# Altium schematic sheet Processing.SchDoc
size A3
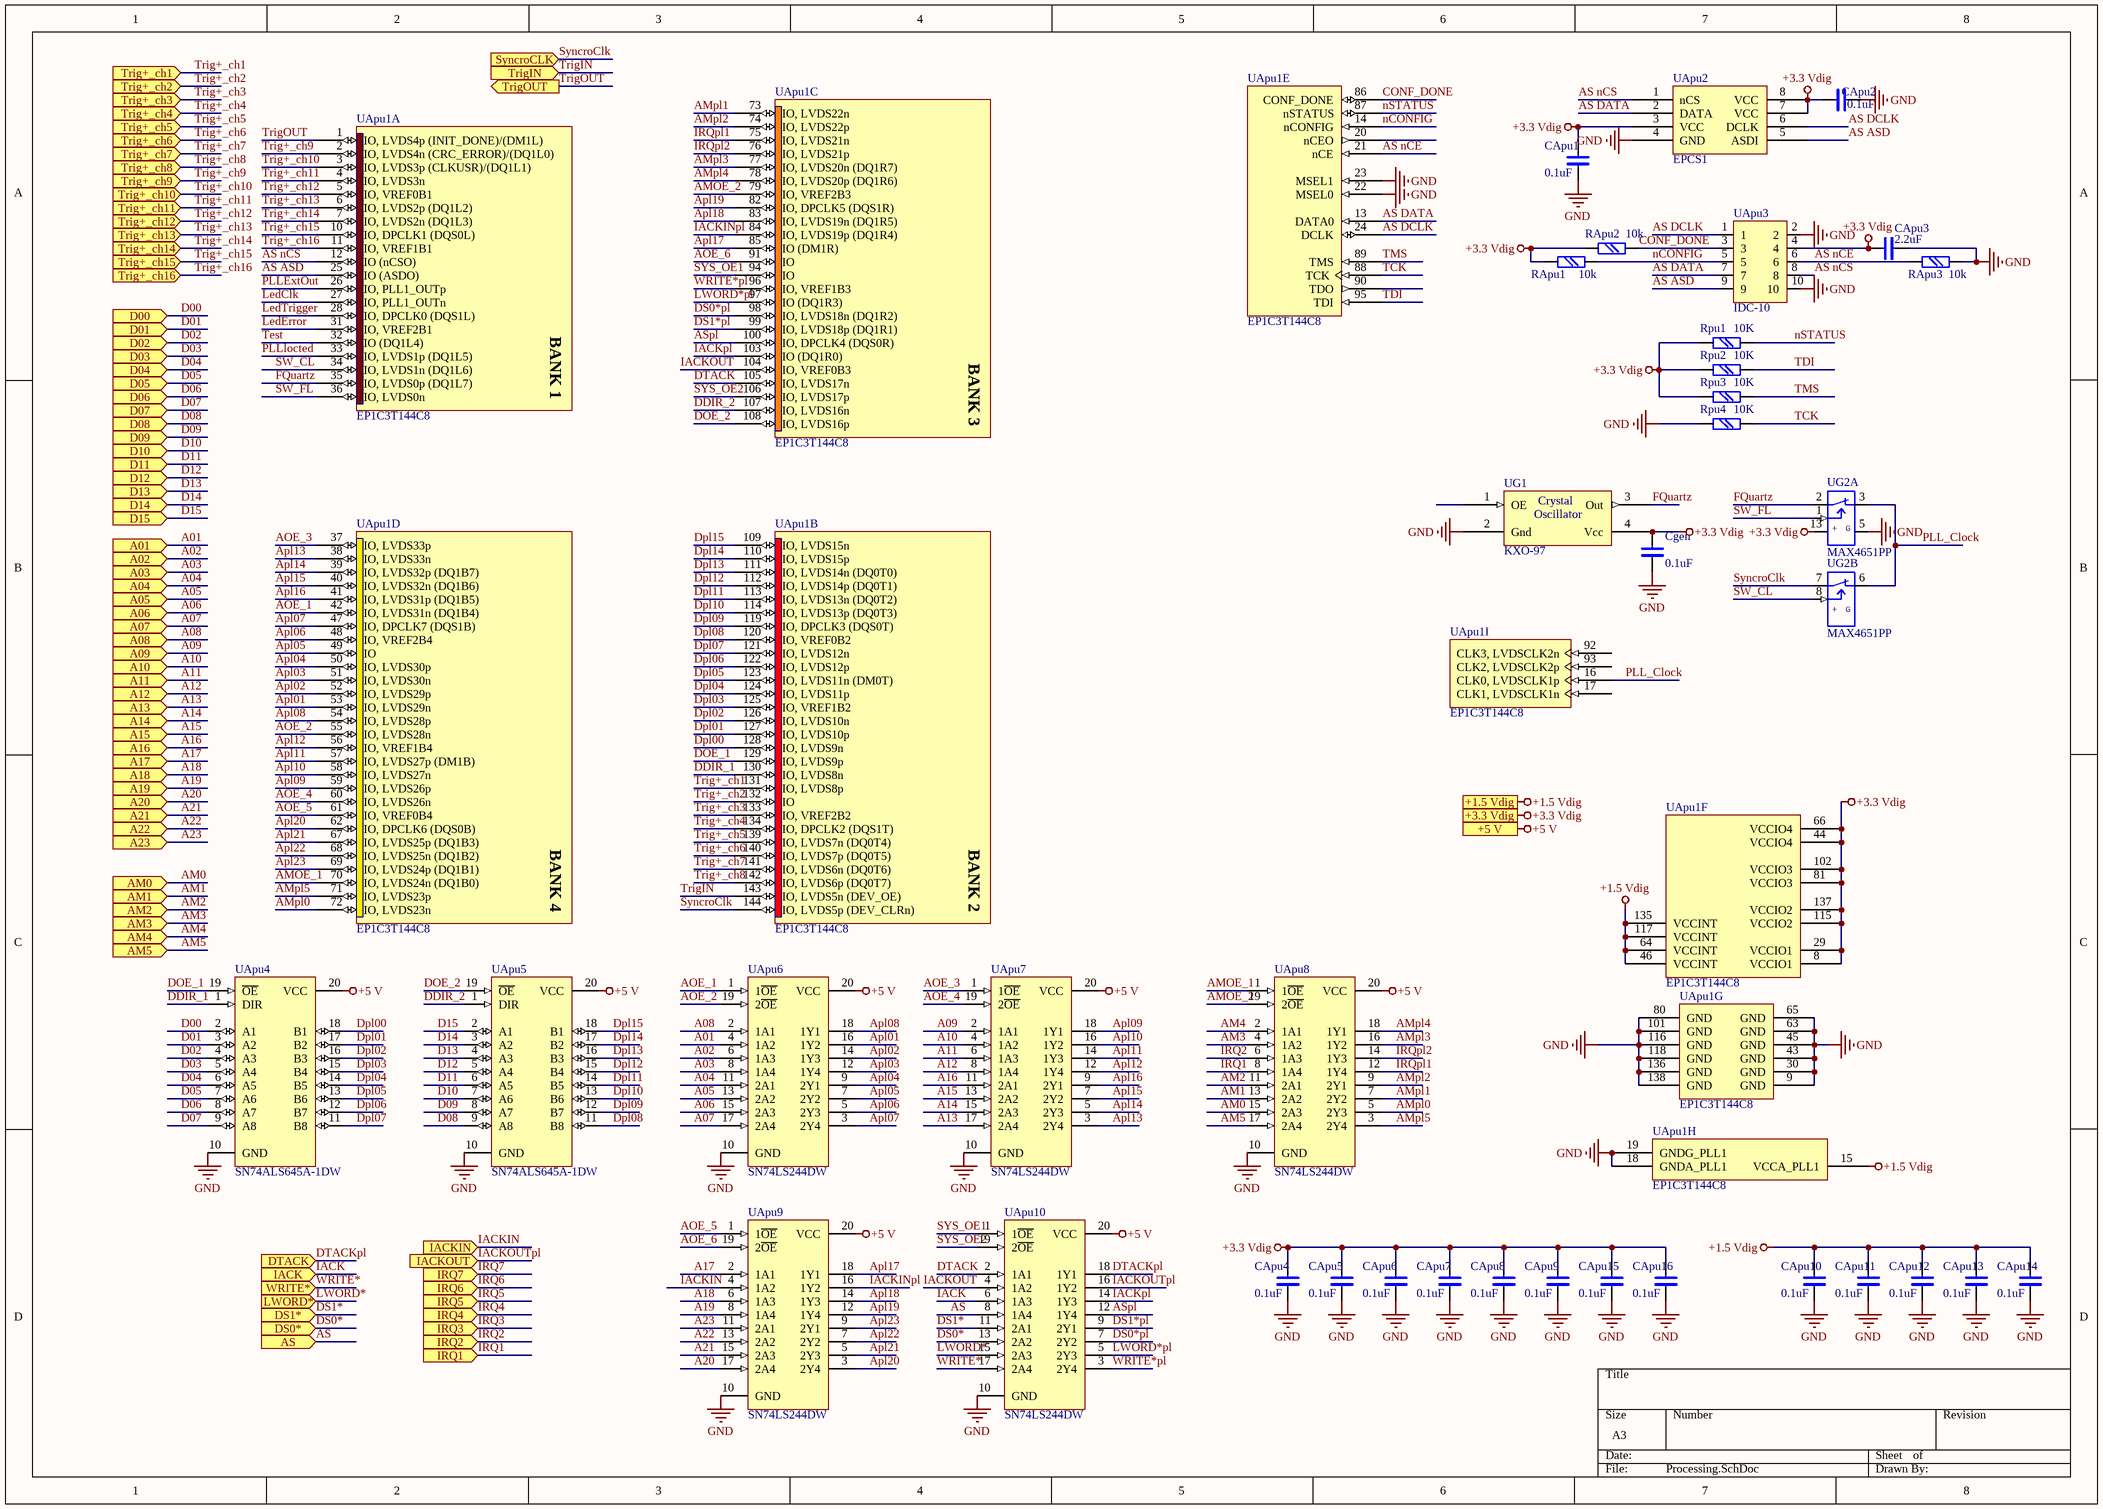
[diagram p0: Processing.SchDoc]

## Parts
CApu1  0.1uF  [chip0805]
CApu2  0.1uF  [chip0805]
CApu3  2.2uF  [chip0805]
CApu4  0.1uF  [chip0805]
CApu5  0.1uF  [chip0805]
CApu6  0.1uF  [chip0805]
CApu7  0.1uF  [chip0805]
CApu8  0.1uF  [chip0805]
CApu9  0.1uF  [chip0805]
CApu10  0.1uF  [chip0805]
CApu11  0.1uF  [chip0805]
CApu12  0.1uF  [chip0805]
CApu13  0.1uF  [chip0805]
CApu14  0.1uF  [chip0805]
CApu15  0.1uF  [chip0805]
CApu16  0.1uF  [chip0805]
Cgen  0.1uF  [chip0805]
RApu1  10k  [chip0805]
RApu2  10k  [chip0805]
RApu3  10k  [chip0805]
Rpu1  10K  [chip0805]
Rpu2  10K  [chip0805]
Rpu3  10K  [chip0805]
Rpu4  10K  [chip0805]
UApu1  EP1C3T144C8  [TQFP144_N]  (parts A,B,C,D,E,F,G,H,I of 9)
UApu2  EPCS1  [8SO200]
UApu3  IDC-10  [IDC10]
UApu4  SN74ALS645A-1DW  [DW020_N]
UApu5  SN74ALS645A-1DW  [DW020_N]
UApu6  SN74LS244DW  [DW020_N]
UApu7  SN74LS244DW  [DW020_N]
UApu8  SN74LS244DW  [DW020_N]
UApu9  SN74LS244DW  [DW020_N]
UApu10  SN74LS244DW  [DW020_N]
UG1  KXO-97  [SG-636]
UG2  MAX4651PP  [16SOIC150]  (parts A,B of 4)

## Ports
+1.5 Vdig (in), +3.3 Vdig (in), +5 V (in), A01 (in), A02 (in), A03 (in), A04 (in), A05 (in), A06 (in), A07 (in), A08 (in), A09 (in), A10 (in), A11 (in), A12 (in), A13 (in), A14 (in), A15 (in), A16 (in), A17 (in), A18 (in), A19 (in), A20 (in), A21 (in), A22 (in), A23 (in), AM0 (in), AM1 (in), AM2 (in), AM3 (in), AM4 (in), AM5 (in), AS (in), D00 (in), D01 (in), D02 (in), D03 (in), D04 (in), D05 (in), D06 (in), D07 (in), D08 (in), D09 (in), D10 (in), D11 (in), D12 (in), D13 (in), D14 (in), D15 (in), DS0* (in), DS1* (in), DTACK (in), IACK (in), IACKIN (in), IACKOUT (in), IRQ1 (in), IRQ2 (in), IRQ3 (in), IRQ4 (in), IRQ5 (in), IRQ6 (in), IRQ7 (in), LWORD* (in), SyncroCLK (in), Trig+_ch1 (in), Trig+_ch2 (in), Trig+_ch3 (in), Trig+_ch4 (in), Trig+_ch5 (in), Trig+_ch6 (in), Trig+_ch7 (in), Trig+_ch8 (in), Trig+_ch9 (in), Trig+_ch10 (in), Trig+_ch11 (in), Trig+_ch12 (in), Trig+_ch13 (in), Trig+_ch14 (in), Trig+_ch15 (in), Trig+_ch16 (in), TrigIN (in), TrigOUT (out), WRITE* (in)

## Nets
+1.5 Vdig: CApu10.2 CApu11.2 CApu12.2 CApu13.2 CApu14.2 UApu1.15(VCCA_PLL1) UApu1.46(VCCINT) UApu1.64(VCCINT) UApu1.117(VCCINT) UApu1.135(VCCINT) ; port +1.5 Vdig
+3.3 Vdig: CApu1.2 CApu2.2 CApu3.1 CApu4.2 CApu5.2 CApu6.2 CApu7.2 CApu8.2 CApu9.2 CApu15.2 CApu16.2 Cgen.2 RApu1.1 RApu2.1 Rpu1.1 Rpu2.1 Rpu3.1 UApu1.8(VCCIO1) UApu1.29(VCCIO1) UApu1.44(VCCIO4) UApu1.66(VCCIO4) UApu1.81(VCCIO3) UApu1.102(VCCIO3) UApu1.115(VCCIO2) UApu1.137(VCCIO2) UApu2.3(VCC) UApu2.7(VCC) UApu2.8(VCC) UApu3.4 UG1.4(Vcc) UG2.13(VCC) ; port +3.3 Vdig
+5 V: UApu4.20(VCC) UApu5.20(VCC) UApu6.20(VCC) UApu7.20(VCC) UApu8.20(VCC) UApu9.20(VCC) UApu10.20(VCC) ; port +5 V
GND: CApu1.1 CApu2.1 CApu3.2 CApu4.1 CApu5.1 CApu6.1 CApu7.1 CApu8.1 CApu9.1 CApu10.1 CApu11.1 CApu12.1 CApu13.1 CApu14.1 CApu15.1 CApu16.1 Cgen.1 RApu3.2 Rpu4.1 UApu1.9(GND) UApu1.18(GNDA_PLL1) UApu1.19(GNDG_PLL1) UApu1.22(MSEL0) UApu1.23(MSEL1) UApu1.30(GND) UApu1.43(GND) UApu1.45(GND) UApu1.63(GND) UApu1.65(GND) UApu1.80(GND) UApu1.101(GND) UApu1.116(GND) UApu1.118(GND) UApu1.136(GND) UApu1.138(GND) UApu2.4(GND) UApu3.2 UApu3.10 UApu4.10(GND) UApu5.10(GND) UApu6.10(GND) UApu7.10(GND) UApu8.10(GND) UApu9.10(GND) UApu10.10(GND) UG1.2(Gnd) UG2.5(GND)
A01: UApu6.4(1A2) ; port A01
A02: UApu6.6(1A3) ; port A02
A03: UApu6.8(1A4) ; port A03
A04: UApu6.11(2A1) ; port A04
A05: UApu6.13(2A2) ; port A05
A06: UApu6.15(2A3) ; port A06
A07: UApu6.17(2A4) ; port A07
A08: UApu6.2(1A1) ; port A08
A09: UApu7.2(1A1) ; port A09
A10: UApu7.4(1A2) ; port A10
A11: UApu7.6(1A3) ; port A11
A12: UApu7.8(1A4) ; port A12
A13: UApu7.17(2A4) ; port A13
A14: UApu7.15(2A3) ; port A14
A15: UApu7.13(2A2) ; port A15
A16: UApu7.11(2A1) ; port A16
A17: UApu9.2(1A1) ; port A17
A18: UApu9.6(1A3) ; port A18
A19: UApu9.8(1A4) ; port A19
A20: UApu9.17(2A4) ; port A20
A21: UApu9.15(2A3) ; port A21
A22: UApu9.13(2A2) ; port A22
A23: UApu9.11(2A1) ; port A23
AM0: UApu8.15(2A3) ; port AM0
AM1: UApu8.13(2A2) ; port AM1
AM2: UApu8.11(2A1) ; port AM2
AM3: UApu8.4(1A2) ; port AM3
AM4: UApu8.2(1A1) ; port AM4
AM5: UApu8.17(2A4) ; port AM5
AMOE_1: UApu1.70(IO,_LVDS24n_(DQ1B0)) UApu8.1(1~{OE})
AMOE_2: UApu1.79(IO,_VREF2B3) UApu8.19(2~{OE})
AMpl0: UApu1.72(IO,_LVDS23n) UApu8.5(2Y3)
AMpl1: UApu1.73(IO,_LVDS22n) UApu8.7(2Y2)
AMpl2: UApu1.74(IO,_LVDS22p) UApu8.9(2Y1)
AMpl3: UApu1.77(IO,_LVDS20n_(DQ1R7)) UApu8.16(1Y2)
AMpl4: UApu1.78(IO,_LVDS20p_(DQ1R6)) UApu8.18(1Y1)
AMpl5: UApu1.71(IO,_LVDS23p) UApu8.3(2Y4)
AOE_1: UApu1.42(IO,_LVDS31n_(DQ1B4)) UApu6.1(1~{OE})
AOE_2: UApu1.55(IO,_LVDS28n) UApu6.19(2~{OE})
AOE_3: UApu1.37(IO,_LVDS33p) UApu7.1(1~{OE})
AOE_4: UApu1.60(IO,_LVDS26n) UApu7.19(2~{OE})
AOE_5: UApu1.61(IO,_VREF0B4) UApu9.1(1~{OE})
AOE_6: UApu1.91(IO) UApu9.19(2~{OE})
Apl01: UApu1.53(IO,_LVDS29n) UApu6.16(1Y2)
Apl02: UApu1.52(IO,_LVDS29p) UApu6.14(1Y3)
Apl03: UApu1.51(IO,_LVDS30n) UApu6.12(1Y4)
Apl04: UApu1.50(IO,_LVDS30p) UApu6.9(2Y1)
Apl05: UApu1.49(IO) UApu6.7(2Y2)
Apl06: UApu1.48(IO,_VREF2B4) UApu6.5(2Y3)
Apl07: UApu1.47(IO,_DPCLK7_(DQS1B)) UApu6.3(2Y4)
Apl08: UApu1.54(IO,_LVDS28p) UApu6.18(1Y1)
Apl09: UApu1.59(IO,_LVDS26p) UApu7.18(1Y1)
Apl10: UApu1.58(IO,_LVDS27n) UApu7.16(1Y2)
Apl11: UApu1.57(IO,_LVDS27p_(DM1B)) UApu7.14(1Y3)
Apl12: UApu1.56(IO,_VREF1B4) UApu7.12(1Y4)
Apl13: UApu1.38(IO,_LVDS33n) UApu7.3(2Y4)
Apl14: UApu1.39(IO,_LVDS32p_(DQ1B7)) UApu7.5(2Y3)
Apl15: UApu1.40(IO,_LVDS32n_(DQ1B6)) UApu7.7(2Y2)
Apl16: UApu1.41(IO,_LVDS31p_(DQ1B5)) UApu7.9(2Y1)
Apl17: UApu1.85(IO_(DM1R)) UApu9.18(1Y1)
Apl18: UApu1.83(IO,_LVDS19n_(DQ1R5)) UApu9.14(1Y3)
Apl19: UApu1.82(IO,_DPCLK5_(DQS1R)) UApu9.12(1Y4)
Apl20: UApu1.62(IO,_DPCLK6_(DQS0B)) UApu9.3(2Y4)
Apl21: UApu1.67(IO,_LVDS25p_(DQ1B3)) UApu9.5(2Y3)
Apl22: UApu1.68(IO,_LVDS25n_(DQ1B2)) UApu9.7(2Y2)
Apl23: UApu1.69(IO,_LVDS24p_(DQ1B1)) UApu9.9(2Y1)
AS: UApu10.8(1A4) ; port AS
AS ASD: UApu1.25(IO_(ASDO)) UApu2.5(ASDI) UApu3.9
AS DATA: UApu1.13(DATA0) UApu2.2(DATA) UApu3.7
AS DCLK: UApu1.24(DCLK) UApu2.6(DCLK) UApu3.1
AS nCE: RApu3.1 UApu1.21(nCE) UApu3.6
AS nCS: UApu1.12(IO_(nCSO)) UApu2.1(nCS) UApu3.8
ASpl: UApu1.100(IO,_DPCLK4_(DQS0R)) UApu10.12(1Y4)
CONF_DONE: RApu2.2 UApu1.86(CONF_DONE) UApu3.3
D00: UApu4.2(A1) ; port D00
D01: UApu4.3(A2) ; port D01
D02: UApu4.4(A3) ; port D02
D03: UApu4.5(A4) ; port D03
D04: UApu4.6(A5) ; port D04
D05: UApu4.7(A6) ; port D05
D06: UApu4.8(A7) ; port D06
D07: UApu4.9(A8) ; port D07
D08: UApu5.9(A8) ; port D08
D09: UApu5.8(A7) ; port D09
D10: UApu5.7(A6) ; port D10
D11: UApu5.6(A5) ; port D11
D12: UApu5.5(A4) ; port D12
D13: UApu5.4(A3) ; port D13
D14: UApu5.3(A2) ; port D14
D15: UApu5.2(A1) ; port D15
DDIR_1: UApu1.130(IO,_LVDS8n) UApu4.1(DIR)
DDIR_2: UApu1.107(IO,_LVDS16n) UApu5.1(DIR)
DOE_1: UApu1.129(IO,_LVDS9p) UApu4.19(~{OE})
DOE_2: UApu1.108(IO,_LVDS16p) UApu5.19(~{OE})
Dpl00: UApu1.128(IO,_LVDS9n) UApu4.18(B1)
Dpl01: UApu1.127(IO,_LVDS10p) UApu4.17(B2)
Dpl02: UApu1.126(IO,_LVDS10n) UApu4.16(B3)
Dpl03: UApu1.125(IO,_VREF1B2) UApu4.15(B4)
Dpl04: UApu1.124(IO,_LVDS11p) UApu4.14(B5)
Dpl05: UApu1.123(IO,_LVDS11n_(DM0T)) UApu4.13(B6)
Dpl06: UApu1.122(IO,_LVDS12p) UApu4.12(B7)
Dpl07: UApu1.121(IO,_LVDS12n) UApu4.11(B8)
Dpl08: UApu1.120(IO,_VREF0B2) UApu5.11(B8)
Dpl09: UApu1.119(IO,_DPCLK3_(DQS0T)) UApu5.12(B7)
Dpl10: UApu1.114(IO,_LVDS13p_(DQ0T3)) UApu5.13(B6)
Dpl11: UApu1.113(IO,_LVDS13n_(DQ0T2)) UApu5.14(B5)
Dpl12: UApu1.112(IO,_LVDS14p_(DQ0T1)) UApu5.15(B4)
Dpl13: UApu1.111(IO,_LVDS14n_(DQ0T0)) UApu5.16(B3)
Dpl14: UApu1.110(IO,_LVDS15p) UApu5.17(B2)
Dpl15: UApu1.109(IO,_LVDS15n) UApu5.18(B1)
DS0*: UApu10.13(2A2) ; port DS0*
DS0*pl: UApu1.98(IO,_LVDS18n_(DQ1R2)) UApu10.7(2Y2)
DS1*: UApu10.11(2A1) ; port DS1*
DS1*pl: UApu1.99(IO,_LVDS18p_(DQ1R1)) UApu10.9(2Y1)
DTACK: UApu1.105(IO,_LVDS17n) UApu10.2(1A1)
DTACKpl: UApu10.18(1Y1) ; port DTACK
FQuartz: UApu1.35(IO,_LVDS0p_(DQ1L7)) UG1.3(Out) UG2.2(IN)
IACK: UApu10.6(1A3) ; port IACK
IACKIN: UApu9.4(1A2) ; port IACKIN
IACKINpl: UApu1.84(IO,_LVDS19p_(DQ1R4)) UApu9.16(1Y2)
IACKOUT: UApu1.104(IO,_VREF0B3) UApu10.4(1A2)
IACKOUTpl: UApu10.16(1Y2) ; port IACKOUT
IACKpl: UApu1.103(IO_(DQ1R0)) UApu10.14(1Y3)
IRQ1: UApu8.8(1A4) ; port IRQ1
IRQ2: UApu8.6(1A3) ; port IRQ2
IRQ3: port IRQ3
IRQ4: port IRQ4
IRQ5: port IRQ5
IRQ6: port IRQ6
IRQ7: port IRQ7
IRQpl1: UApu1.75(IO,_LVDS21n) UApu8.12(1Y4)
IRQpl2: UApu1.76(IO,_LVDS21p) UApu8.14(1Y3)
LedClk: UApu1.27(IO,_PLL1_OUTn)
LedError: UApu1.31(IO,_VREF2B1)
LedTrigger: UApu1.28(IO,_DPCLK0_(DQS1L))
LWORD*: UApu10.15(2A3) ; port LWORD*
LWORD*pl: UApu1.97(IO_(DQ1R3)) UApu10.5(2Y3)
nCONFIG: RApu1.2 UApu1.14(nCONFIG) UApu3.5
nSTATUS: Rpu1.2 UApu1.87(nSTATUS)
PLL_Clock: UApu1.16(CLK0,_LVDSCLK1p) UG2.3(OUT) UG2.6(OUT)
PLLExtOut: UApu1.26(IO,_PLL1_OUTp)
PLLlocted: UApu1.33(IO,_LVDS1p_(DQ1L5))
SW_CL: UApu1.34(IO,_LVDS1n_(DQ1L6)) UG2.8(CONTROL)
SW_FL: UApu1.36(IO,_LVDS0n) UG2.1(CONTROL)
SyncroClk: UApu1.144(IO,_LVDS5p_(DEV_CLRn)) UG2.7(IN) ; port SyncroCLK
SYS_OE1: UApu1.94(IO) UApu10.1(1~{OE})
SYS_OE2: UApu1.106(IO,_LVDS17p) UApu10.19(2~{OE})
TCK: Rpu4.2 UApu1.88(TCK)
TDI: Rpu2.2 UApu1.95(TDI)
Test: UApu1.32(IO_(DQ1L4))
TMS: Rpu3.2 UApu1.89(TMS)
Trig+_ch1: UApu1.131(IO,_LVDS8p) ; port Trig+_ch1
Trig+_ch2: UApu1.132(IO) ; port Trig+_ch2
Trig+_ch3: UApu1.133(IO,_VREF2B2) ; port Trig+_ch3
Trig+_ch4: UApu1.134(IO,_DPCLK2_(DQS1T)) ; port Trig+_ch4
Trig+_ch5: UApu1.139(IO,_LVDS7n_(DQ0T4)) ; port Trig+_ch5
Trig+_ch6: UApu1.140(IO,_LVDS7p_(DQ0T5)) ; port Trig+_ch6
Trig+_ch7: UApu1.141(IO,_LVDS6n_(DQ0T6)) ; port Trig+_ch7
Trig+_ch8: UApu1.142(IO,_LVDS6p_(DQ0T7)) ; port Trig+_ch8
Trig+_ch9: UApu1.2(IO,_LVDS4n_(CRC_ERROR)/(DQ1L0)) ; port Trig+_ch9
Trig+_ch10: UApu1.3(IO,_LVDS3p_(CLKUSR)/(DQ1L1)) ; port Trig+_ch10
Trig+_ch11: UApu1.4(IO,_LVDS3n) ; port Trig+_ch11
Trig+_ch12: UApu1.5(IO,_VREF0B1) ; port Trig+_ch12
Trig+_ch13: UApu1.6(IO,_LVDS2p_(DQ1L2)) ; port Trig+_ch13
Trig+_ch14: UApu1.7(IO,_LVDS2n_(DQ1L3)) ; port Trig+_ch14
Trig+_ch15: UApu1.10(IO,_DPCLK1_(DQS0L)) ; port Trig+_ch15
Trig+_ch16: UApu1.11(IO,_VREF1B1) ; port Trig+_ch16
TrigIN: UApu1.143(IO,_LVDS5n_(DEV_OE)) ; port TrigIN
TrigOUT: UApu1.1(IO,_LVDS4p_(INIT_DONE)/(DM1L)) ; port TrigOUT
WRITE*: UApu10.17(2A4) ; port WRITE*
WRITE*pl: UApu1.96(IO,_VREF1B3) UApu10.3(2Y4)

Not connected (* = marked no-connect by the designer): UApu1 17(CLK1,_LVDSCLK1n) 20(nCEO) 90(TDO) 92(CLK3,_LVDSCLK2n) 93(CLK2,_LVDSCLK2p); UG1 1(OE)

## Notes on the sheet
- (in symbol EP1C3T144C8, part A) BANK 1
- (in symbol EP1C3T144C8, part B) BANK 2
- (in symbol EP1C3T144C8, part C) BANK 3
- (in symbol EP1C3T144C8, part D) BANK 4
- (in symbol MAX4651PP, part A) +; G
- (in symbol MAX4651PP, part B) +; G
- (in symbol SG-636) Crystal; Oscillator

## Library data of the parts
CApu1-CApu16 Cgen = C: Text Field1: 20; Text Field2: 10
RApu1-RApu3 Rpu1-Rpu4 = R: Text Field1: 20; Text Field2: 20
UApu1 = EP1C3T144C8: Cyclone Family, 1.5V FPGA, 104 I/O Pins, 1 x PLL, Commercial Grade, Speed Grade 8; Published: 17-Sep-2003; LatestRevisionDate: 13-Apr-2006; LatestRevisionNote: Pin 2 name fix, IPC-7351 Footprint Added.; DatasheetVersion: ver2.4, May-2008; PackageVersion: ver15.4, Dec-2008; PackageReference: TQFP144; Publisher: Altium Limited; PackageDescription: 144-Pin Plastic Thin Quad Flat Pack (TQFP144) - Wire Bond; Supplier 1: Digi-Key; Supplier Part Number 1: 544-1052-ND; Code_JEDEC: MS-026-BFB; ComponentLink1Description: Manufacturer Link; ComponentLink1URL: http://www.altera.com/products/devices/cyclone/cyc-index.jsp; ComponentLink2Description: Handbook; ComponentLink2URL: http://www.altera.com/literature/hb/cyc/cyc_c5v1.pdf; ComponentLink3Description: Packaging Specification; ComponentLink3URL: http://www.altera.com/literature/ds/dspkg.pdf
UApu2 = EPCS1: Serial configuration device for Cyclone (Altera)
UApu3 = IDC-10: Text Field1: 40; Text Field2: 60
UApu4 UApu5 = SN74ALS645A-1DW: Octal Bus Transceiver with 3-State Outputs; Published: 8-Jun-2000; LatestRevisionDate: 13-Apr-2006; LatestRevisionNote: IPC-7351 Footprint Added.; DatasheetVersion: Jan-1995; PackageVersion: Mar-2000; PackageReference: DW020; Publisher: Altium Limited; PackageDescription: 20-Pin Plastic Small Outline Integrated Circuit 1.27 mm Pitch; Code_JEDEC: MS-013; Code_IPC: SOIC127P1030-20; ComponentLink1Description: Manufacturer Link; ComponentLink1URL: http://www.ti.com/; ComponentLink2Description: Datasheet; ComponentLink2URL: http://www-s.ti.com/sc/ds/sn74als645a.pdf
UApu6-UApu10 = SN74LS244DW: Octal Buffer and Line Driver with 3-State Outputs; ComponentAvailability: Obsolete; Published: 8-Jun-2000; LatestRevisionDate: 13-Apr-2006; LatestRevisionNote: IPC-7351 Footprint Added.; DatasheetVersion: Mar-1988; PackageVersion: Mar-2000; PackageReference: DW020; Publisher: Altium Limited; PackageDescription: 20-Pin Plastic Small Outline Integrated Circuit 1.27 mm Pitch; Code_JEDEC: MS-013; Code_IPC: SOIC127P1030-20; ComponentLink1Description: Manufacturer Link; ComponentLink1URL: http://www.ti.com/; ComponentLink2Description: Datasheet; ComponentLink2URL: http://www-s.ti.com/sc/ds/sn74ls240.pdf
UG1 = SG-636: Crystal Oscillator (SMD)
UG2 = MAX4651PP: Text Field1: 20; Text Field2: 40